# Altium schematic sheet CM_FPGA_B0-1.SchDoc
size Tabloid; SheetNumber: 4; SheetTotal: 14; Sheet_Name: CM_FPGA_B0-1; Size: 11x17
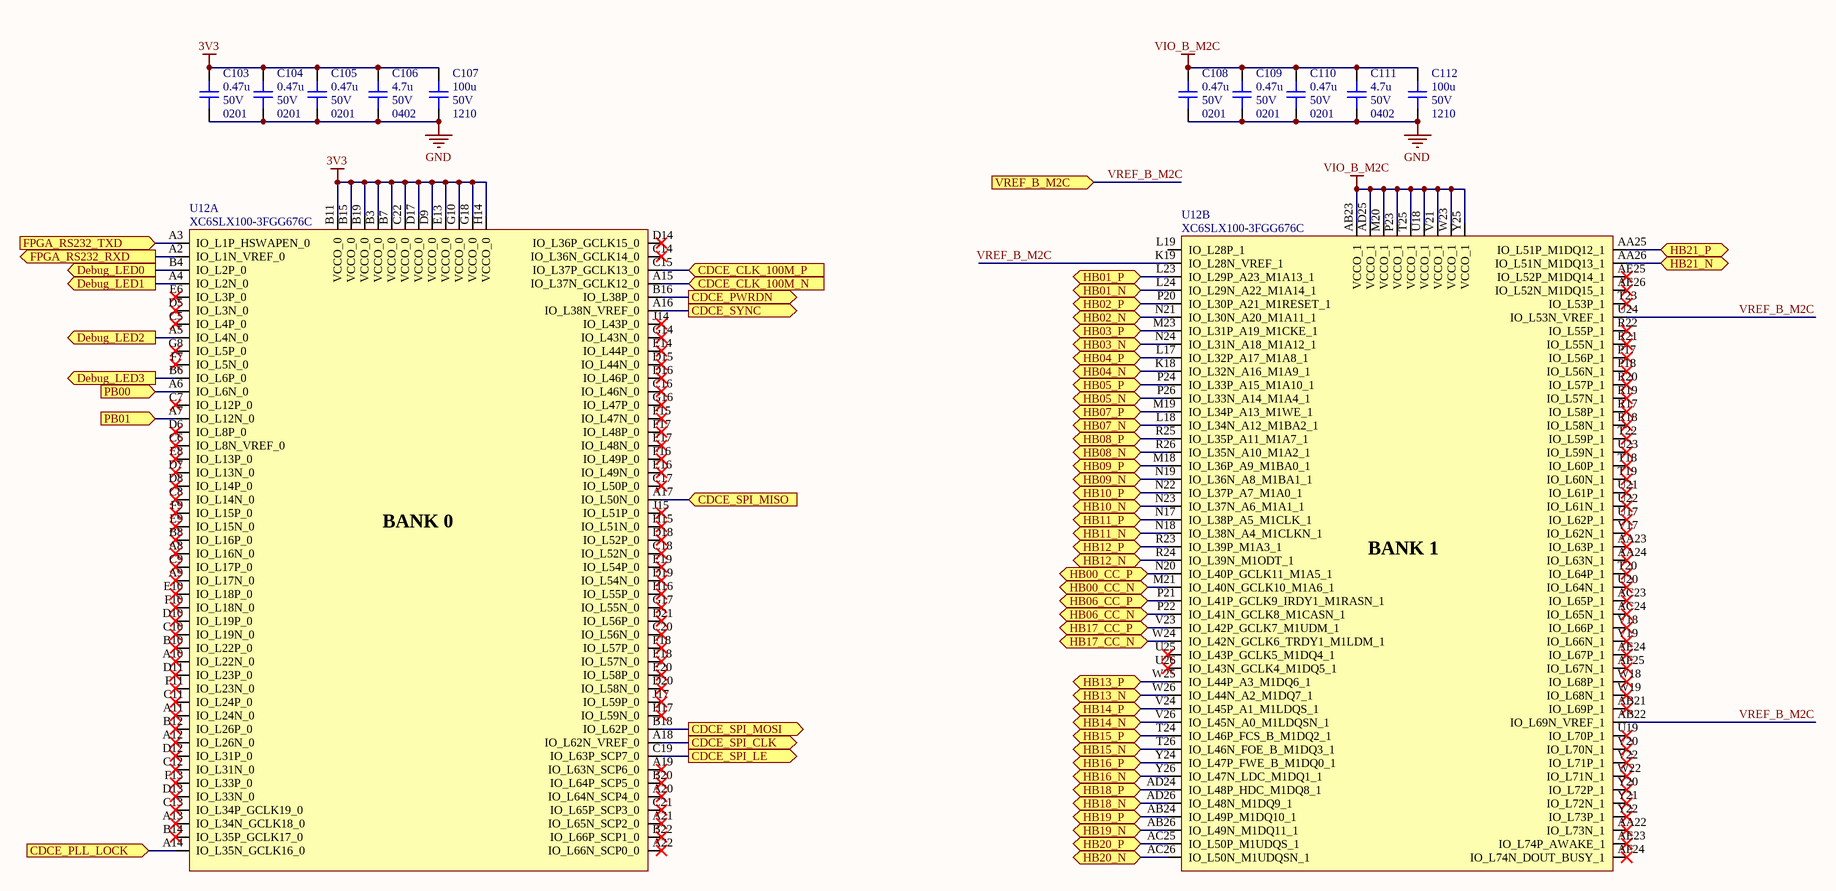
[diagram p0: CM_FPGA_B0-1.SchDoc]

## Parts
C103  value 0.47u  Voltage: 50V  Package: 0201  [CAP_0201]  (hidden comment: CAP - 0201)
C104  value 0.47u  Voltage: 50V  Package: 0201  [CAP_0201]  (hidden comment: CAP - 0201)
C105  value 0.47u  Voltage: 50V  Package: 0201  [CAP_0201]  (hidden comment: CAP - 0201)
C106  value 4.7u  Voltage: 50V  Package: 0402  [CAP_0402]  (hidden comment: CAP - 0402)
C107  value 100u  Voltage: 50V  Package: 1210  [CAP_1210]  (hidden comment: CAP - 1210)
C108  value 0.47u  Voltage: 50V  Package: 0201  [CAP_0201]  (hidden comment: CAP - 0201)
C109  value 0.47u  Voltage: 50V  Package: 0201  [CAP_0201]  (hidden comment: CAP - 0201)
C110  value 0.47u  Voltage: 50V  Package: 0201  [CAP_0201]  (hidden comment: CAP - 0201)
C111  value 4.7u  Voltage: 50V  Package: 0402  [CAP_0402]  (hidden comment: CAP - 0402)
C112  value 100u  Voltage: 50V  Package: 1210  [CAP_1210]  (hidden comment: CAP - 1210)
U12  XC6SLX100-3FGG676C  [FPGA_XILINX_FGG676]  (parts A,B of 10)

## Ports
CDCE_CLK_100M_N (in), CDCE_CLK_100M_P (in), CDCE_PLL_LOCK (in), CDCE_PWRDN (out), CDCE_SPI_CLK (out), CDCE_SPI_LE (out), CDCE_SPI_MISO (in), CDCE_SPI_MOSI (out), CDCE_SYNC (out), Debug_LED0 (out), Debug_LED1 (out), Debug_LED2 (out), Debug_LED3 (out), FPGA_RS232_RXD (out), FPGA_RS232_TXD (in), HB00_CC_N (bidir), HB00_CC_P (bidir), HB01_N (bidir), HB01_P (bidir), HB02_N (bidir), HB02_P (bidir), HB03_N (bidir), HB03_P (bidir), HB04_N (bidir), HB04_P (bidir), HB05_N (bidir), HB05_P (bidir), HB06_CC_N (bidir), HB06_CC_P (bidir), HB07_N (bidir), HB07_P (bidir), HB08_N (bidir), HB08_P (bidir), HB09_N (bidir), HB09_P (bidir), HB10_N (bidir), HB10_P (bidir), HB11_N (bidir), HB11_P (bidir), HB12_N (bidir), HB12_P (bidir), HB13_N (bidir), HB13_P (bidir), HB14_N (bidir), HB14_P (bidir), HB15_N (bidir), HB15_P (bidir), HB16_N (bidir), HB16_P (bidir), HB17_CC_N (bidir), HB17_CC_P (bidir), HB18_N (bidir), HB18_P (bidir), HB19_N (bidir), HB19_P (bidir), HB20_N (bidir), HB20_P (bidir), HB21_N (bidir), HB21_P (bidir), PB00 (in), PB01 (in), VREF_B_M2C (in)

## Nets
3V3: C103.2 C104.2 C105.2 C106.2 C107.2 U12.B3(VCCO_0) U12.B7(VCCO_0) U12.B11(VCCO_0) U12.B15(VCCO_0) U12.B19(VCCO_0) U12.C22(VCCO_0) U12.D9(VCCO_0) U12.D17(VCCO_0) U12.E13(VCCO_0) U12.G10(VCCO_0) U12.G18(VCCO_0) U12.H14(VCCO_0)
GND: C103.1 C104.1 C105.1 C106.1 C107.1 C108.1 C109.1 C110.1 C111.1 C112.1
VIO_B_M2C: C108.2 C109.2 C110.2 C111.2 C112.2 U12.AB23(VCCO_1) U12.AD25(VCCO_1) U12.M20(VCCO_1) U12.P23(VCCO_1) U12.T25(VCCO_1) U12.U18(VCCO_1) U12.V21(VCCO_1) U12.W23(VCCO_1) U12.Y25(VCCO_1)
CDCE_CLK_100M_N: U12.A15(IO_L37N_GCLK12_0) ; port CDCE_CLK_100M_N
CDCE_CLK_100M_P: U12.C15(IO_L37P_GCLK13_0) ; port CDCE_CLK_100M_P
CDCE_PLL_LOCK: U12.A14(IO_L35N_GCLK16_0) ; port CDCE_PLL_LOCK
CDCE_PWRDN: U12.B16(IO_L38P_0) ; port CDCE_PWRDN
CDCE_SPI_CLK: U12.A18(IO_L62N_VREF_0) ; port CDCE_SPI_CLK
CDCE_SPI_LE: U12.C19(IO_L63P_SCP7_0) ; port CDCE_SPI_LE
CDCE_SPI_MISO: U12.A17(IO_L50N_0) ; port CDCE_SPI_MISO
CDCE_SPI_MOSI: U12.B18(IO_L62P_0) ; port CDCE_SPI_MOSI
CDCE_SYNC: U12.A16(IO_L38N_VREF_0) ; port CDCE_SYNC
Debug_LED0: U12.B4(IO_L2P_0) ; port Debug_LED0
Debug_LED1: U12.A4(IO_L2N_0) ; port Debug_LED1
Debug_LED2: U12.A5(IO_L4N_0) ; port Debug_LED2
Debug_LED3: U12.B6(IO_L6P_0) ; port Debug_LED3
FPGA_RS232_RXD: U12.A2(IO_L1N_VREF_0) ; port FPGA_RS232_RXD
FPGA_RS232_TXD: U12.A3(IO_L1P_HSWAPEN_0) ; port FPGA_RS232_TXD
HB00_CC_N: U12.M21(IO_L40N_GCLK10_M1A6_1) ; port HB00_CC_N
HB00_CC_P: U12.N20(IO_L40P_GCLK11_M1A5_1) ; port HB00_CC_P
HB01_N: U12.L24(IO_L29N_A22_M1A14_1) ; port HB01_N
HB01_P: U12.L23(IO_L29P_A23_M1A13_1) ; port HB01_P
HB02_N: U12.N21(IO_L30N_A20_M1A11_1) ; port HB02_N
HB02_P: U12.P20(IO_L30P_A21_M1RESET_1) ; port HB02_P
HB03_N: U12.N24(IO_L31N_A18_M1A12_1) ; port HB03_N
HB03_P: U12.M23(IO_L31P_A19_M1CKE_1) ; port HB03_P
HB04_N: U12.K18(IO_L32N_A16_M1A9_1) ; port HB04_N
HB04_P: U12.L17(IO_L32P_A17_M1A8_1) ; port HB04_P
HB05_N: U12.P26(IO_L33N_A14_M1A4_1) ; port HB05_N
HB05_P: U12.P24(IO_L33P_A15_M1A10_1) ; port HB05_P
HB06_CC_N: U12.P22(IO_L41N_GCLK8_M1CASN_1) ; port HB06_CC_N
HB06_CC_P: U12.P21(IO_L41P_GCLK9_IRDY1_M1RASN_1) ; port HB06_CC_P
HB07_N: U12.L18(IO_L34N_A12_M1BA2_1) ; port HB07_N
HB07_P: U12.M19(IO_L34P_A13_M1WE_1) ; port HB07_P
HB08_N: U12.R26(IO_L35N_A10_M1A2_1) ; port HB08_N
HB08_P: U12.R25(IO_L35P_A11_M1A7_1) ; port HB08_P
HB09_N: U12.N19(IO_L36N_A8_M1BA1_1) ; port HB09_N
HB09_P: U12.M18(IO_L36P_A9_M1BA0_1) ; port HB09_P
HB10_N: U12.N23(IO_L37N_A6_M1A1_1) ; port HB10_N
HB10_P: U12.N22(IO_L37P_A7_M1A0_1) ; port HB10_P
HB11_N: U12.N18(IO_L38N_A4_M1CLKN_1) ; port HB11_N
HB11_P: U12.N17(IO_L38P_A5_M1CLK_1) ; port HB11_P
HB12_N: U12.R24(IO_L39N_M1ODT_1) ; port HB12_N
HB12_P: U12.R23(IO_L39P_M1A3_1) ; port HB12_P
HB13_N: U12.W26(IO_L44N_A2_M1DQ7_1) ; port HB13_N
HB13_P: U12.W25(IO_L44P_A3_M1DQ6_1) ; port HB13_P
HB14_N: U12.V26(IO_L45N_A0_M1LDQSN_1) ; port HB14_N
HB14_P: U12.V24(IO_L45P_A1_M1LDQS_1) ; port HB14_P
HB15_N: U12.T26(IO_L46N_FOE_B_M1DQ3_1) ; port HB15_N
HB15_P: U12.T24(IO_L46P_FCS_B_M1DQ2_1) ; port HB15_P
HB16_N: U12.Y26(IO_L47N_LDC_M1DQ1_1) ; port HB16_N
HB16_P: U12.Y24(IO_L47P_FWE_B_M1DQ0_1) ; port HB16_P
HB17_CC_N: U12.W24(IO_L42N_GCLK6_TRDY1_M1LDM_1) ; port HB17_CC_N
HB17_CC_P: U12.V23(IO_L42P_GCLK7_M1UDM_1) ; port HB17_CC_P
HB18_N: U12.AD26(IO_L48N_M1DQ9_1) ; port HB18_N
HB18_P: U12.AD24(IO_L48P_HDC_M1DQ8_1) ; port HB18_P
HB19_N: U12.AB26(IO_L49N_M1DQ11_1) ; port HB19_N
HB19_P: U12.AB24(IO_L49P_M1DQ10_1) ; port HB19_P
HB20_N: U12.AC26(IO_L50N_M1UDQSN_1) ; port HB20_N
HB20_P: U12.AC25(IO_L50P_M1UDQS_1) ; port HB20_P
HB21_N: U12.AA26(IO_L51N_M1DQ13_1) ; port HB21_N
HB21_P: U12.AA25(IO_L51P_M1DQ12_1) ; port HB21_P
PB00: U12.A6(IO_L6N_0) ; port PB00
PB01: U12.A7(IO_L12N_0) ; port PB01
VREF_B_M2C: U12.AB22(IO_L69N_VREF_1) U12.K19(IO_L28N_VREF_1) U12.U24(IO_L53N_VREF_1) ; port VREF_B_M2C

Not connected (* = marked no-connect by the designer): U12 A8(IO_L16N_0)* A9(IO_L17N_0)* A10(IO_L22N_0)* A11(IO_L24N_0)* A12(IO_L26N_0)* A13(IO_L34N_GCLK18_0)* A19(IO_L63N_SCP6_0)* A20(IO_L64N_SCP4_0)* A21(IO_L65N_SCP2_0)* A22(IO_L66N_SCP0_0)* AA22(IO_L73N_1)* AA23(IO_L63P_1)* AA24(IO_L63N_1)* AB21(IO_L69P_1)* AC23(IO_L65P_1)* AC24(IO_L65N_1)* AE23(IO_L74P_AWAKE_1)* AE24(IO_L67P_1)* AE25(IO_L52P_M1DQ14_1)* AE26(IO_L52N_M1DQ15_1)* AF24(IO_L74N_DOUT_BUSY_1)* AF25(IO_L67N_1)* B8(IO_L16P_0)* B10(IO_L22P_0)* B12(IO_L26P_0)* B14(IO_L35P_GCLK17_0)* B20(IO_L64P_SCP5_0)* B22(IO_L66P_SCP1_0)* C5(IO_L4P_0)* C6(IO_L8N_VREF_0)* C7(IO_L12P_0)* C8(IO_L14N_0)* C9(IO_L17P_0)* C10(IO_L19N_0)* C11(IO_L24P_0)* C12(IO_L31N_0)* C13(IO_L34P_GCLK19_0)* C14(IO_L36N_GCLK14_0)* C16(IO_L46N_0)* C17(IO_L50P_0)* C18(IO_L52N_0)* C20(IO_L56N_0)* C21(IO_L65P_SCP3_0)* D5(IO_L3N_0)* D6(IO_L8P_0)* D7(IO_L13N_0)* D8(IO_L14P_0)* D10(IO_L19P_0)* D11(IO_L23P_0)* D12(IO_L31P_0)* D13(IO_L33N_0)* D14(IO_L36P_GCLK15_0)* D15(IO_L44N_0)* D16(IO_L46P_0)* D18(IO_L52P_0)* D19(IO_L54N_0)* D20(IO_L58N_0)* D21(IO_L56P_0)* E6(IO_L3P_0)* E8(IO_L13P_0)* E9(IO_L15N_0)* E10(IO_L18P_0)* E14(IO_L44P_0)* E16(IO_L49N_0)* E17(IO_L48N_0)* E18(IO_L57N_0)* E19(IO_L54P_0)* E20(IO_L58P_0)* F7(IO_L5N_0)* F9(IO_L15P_0)* F10(IO_L18N_0)* F11(IO_L23N_0)* F13(IO_L33P_0)* F15(IO_L47N_0)* F16(IO_L49P_0)* F17(IO_L48P_0)* F18(IO_L57P_0)* G8(IO_L5P_0)* G14(IO_L43N_0)* G16(IO_L47P_0)* G17(IO_L55N_0)* H15(IO_L51N_0)* H16(IO_L55P_0)* H17(IO_L59N_0)* J14(IO_L43P_0)* J15(IO_L51P_0)* J17(IO_L59P_0)* L19(IO_L28P_1) P17(IO_L56P_1)* P18(IO_L56N_1)* R17(IO_L58P_1)* R18(IO_L58N_1)* R19(IO_L57N_1)* R20(IO_L57P_1)* R21(IO_L55N_1)* R22(IO_L55P_1)* T18(IO_L60P_1)* T19(IO_L60N_1)* T20(IO_L64P_1)* T22(IO_L59P_1)* T23(IO_L53P_1)* U17(IO_L62P_1)* U19(IO_L70P_1)* U20(IO_L64N_1)* U21(IO_L61P_1)* U22(IO_L61N_1)* U23(IO_L59N_1)* U25(IO_L43P_GCLK5_M1DQ4_1)* U26(IO_L43N_GCLK4_M1DQ5_1)* V17(IO_L62N_1)* V18(IO_L66P_1)* V19(IO_L66N_1)* V20(IO_L70N_1)* V22(IO_L71P_1)* W18(IO_L68P_1)* W19(IO_L68N_1)* W22(IO_L71N_1)* Y20(IO_L72P_1)* Y21(IO_L72N_1)* Y22(IO_L73P_1)*

## Notes on the sheet
- Sheet Name
- Project Title
- Global Project
- Size
- Group
- Revision
- Date
- Sheet
- of
- Filename
- Designers
- (in symbol FPGA_XC6SLX100-3FGG676C, part A) BANK 0
- (in symbol FPGA_XC6SLX100-3FGG676C, part B) BANK 1

## Library data of the parts
C103-C105 C108-C110 = CAP - 0201: Precision: 10%; Current: *; CreatedBy: Jonathan Bouchard; Power: *
C106 C111 = CAP - 0402: Precision: 10%; Current: *; CreatedBy: Jonathan Bouchard; Power: *
C107 C112 = CAP - 1210: Precision: 10%; Current: *; CreatedBy: Jonathan Bouchard; Power: *
U12 = FPGA_XC6SLX100-3FGG676C: FPGA - XILINX SPARTAN 6 480 I/O - BGA-676; Voltage: 1.14 V ~ 1.26 V; Current: *; Power: *; Mfg: Xilinx; Mfg Part Number: XC6SLX100-3FGG676C; HelpURL: https://www.xilinx.com/support/documentation/data_sheets/ds162.pdf; CreatedBy: Jonathan Bouchard; Temperature: 0°C ~ 85°C (TJ); Value: *; Precision: *; Package: BGA-676; Supplier 1: Digikey; Supplier Part Number 1: 122-1760-ND